# EAGLE schematic OPTOCAPE (EAGLE 6.6.0)
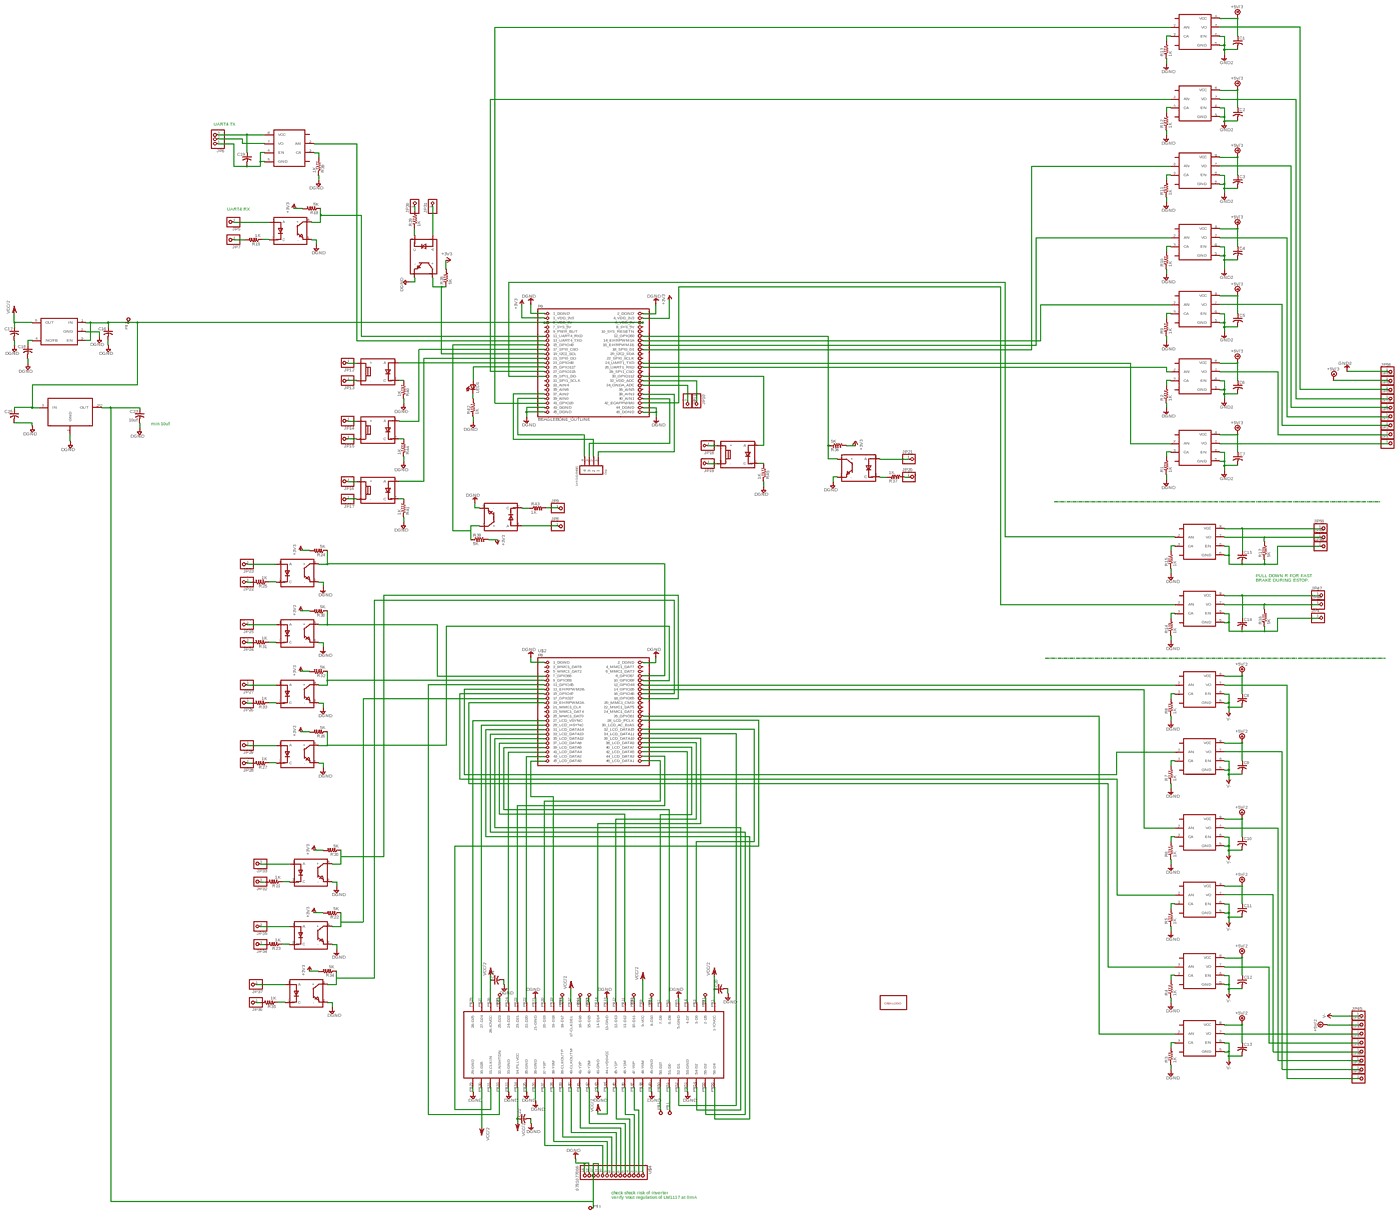
[diagram p0: schematic, sheet 1, overview]
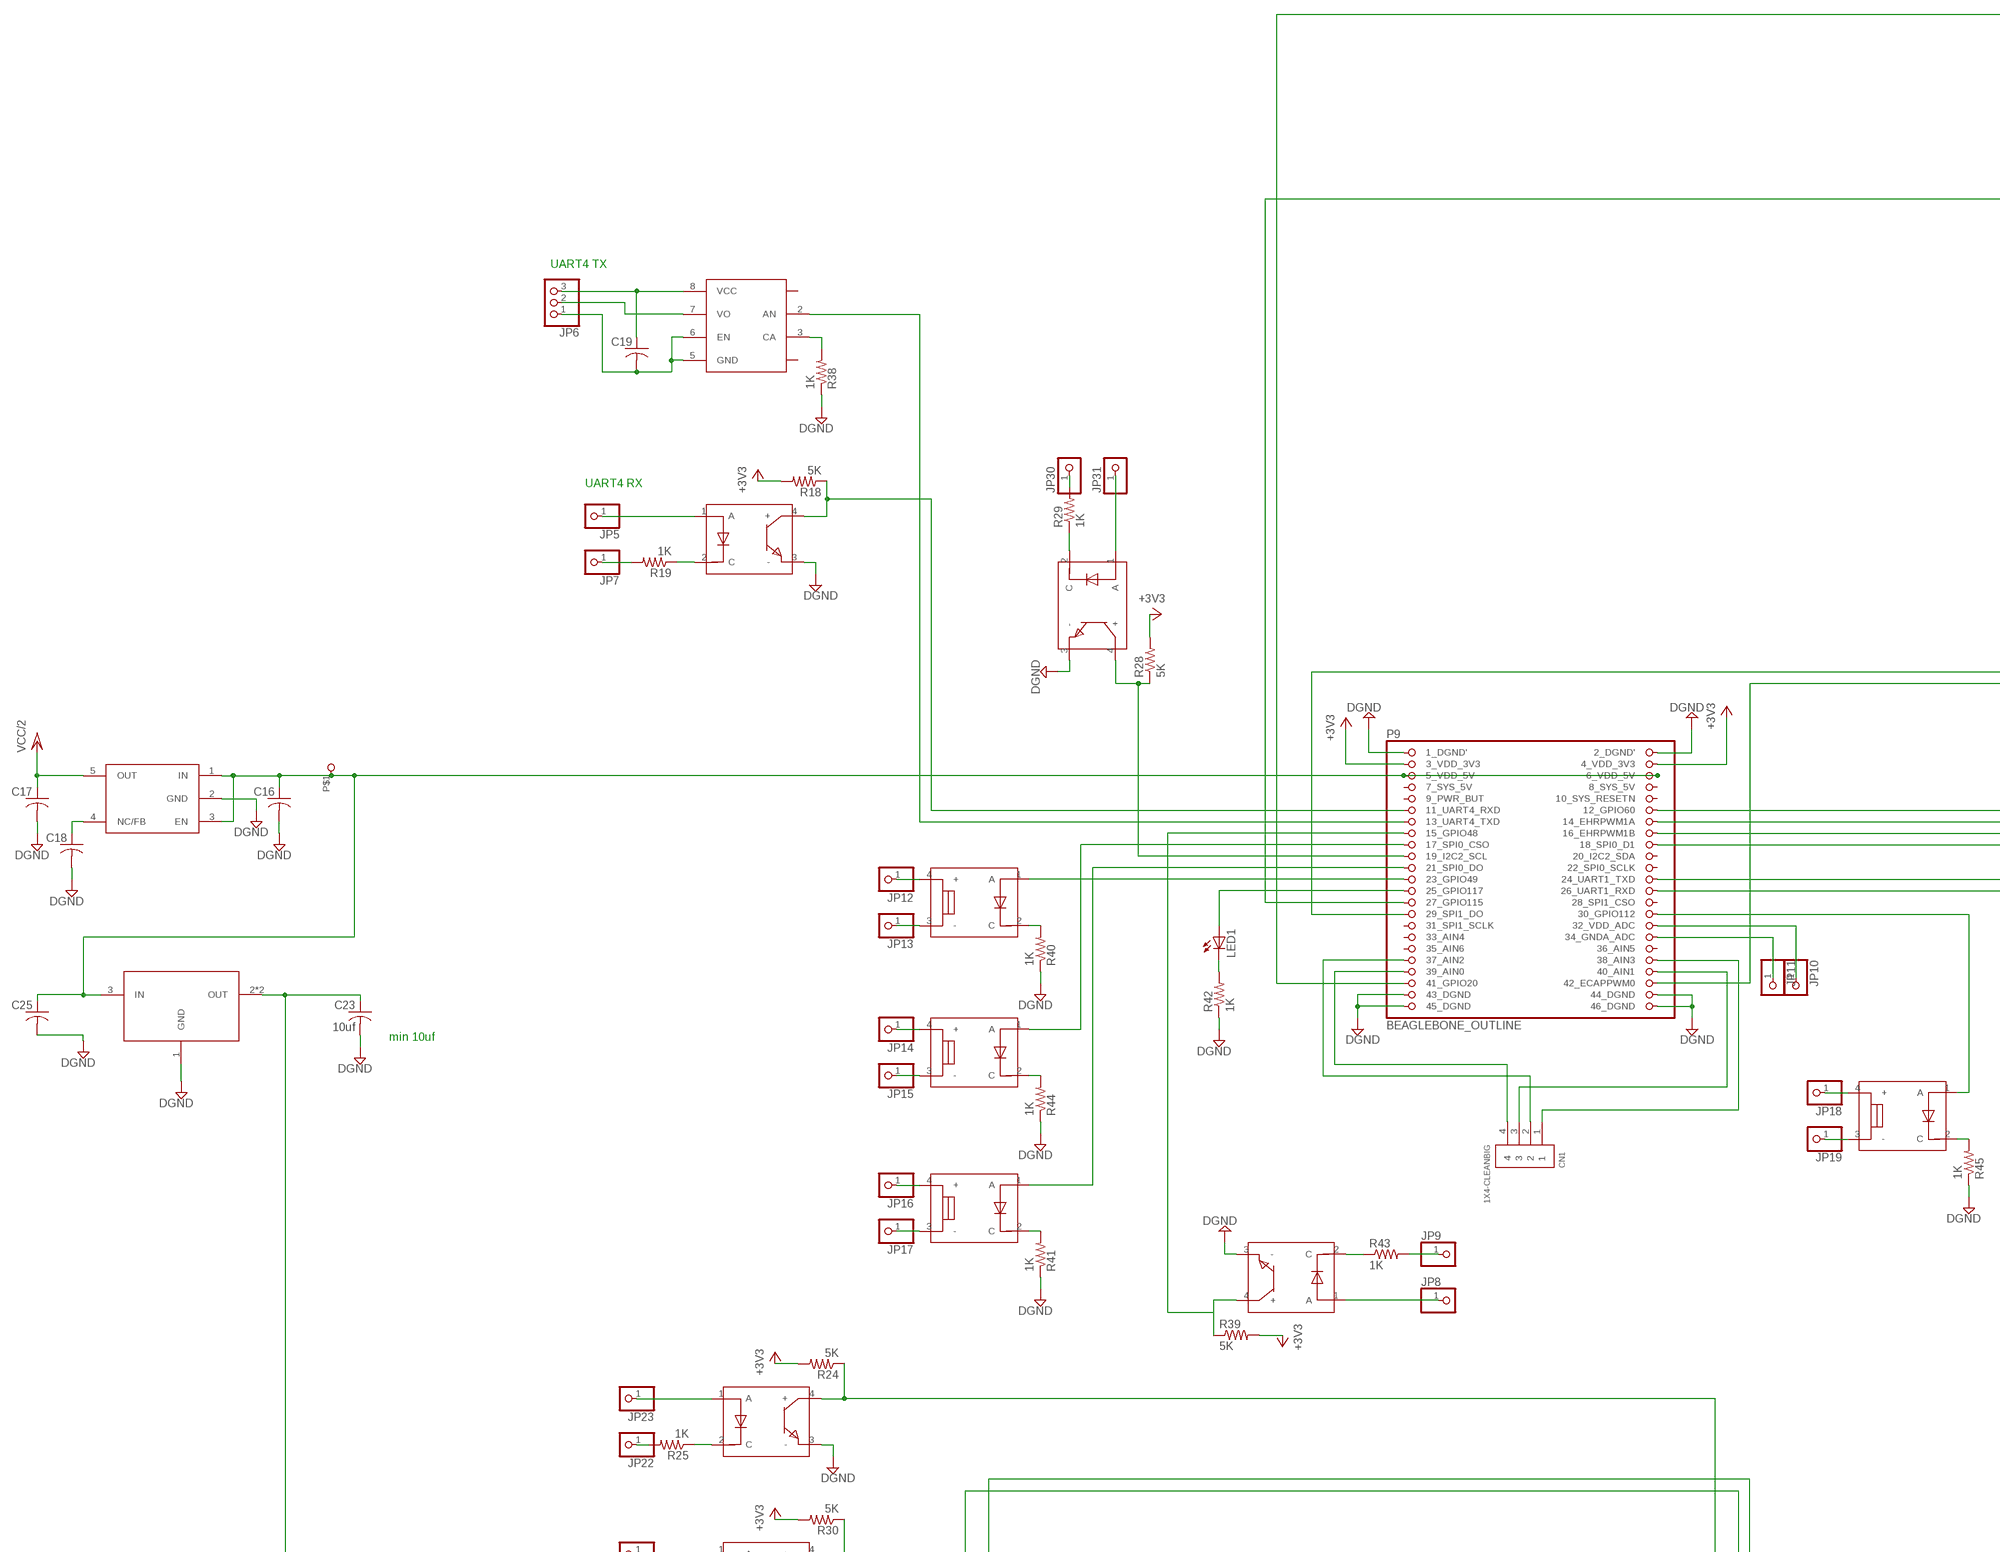
[diagram p1: schematic, sheet 1, part 1 of 4]
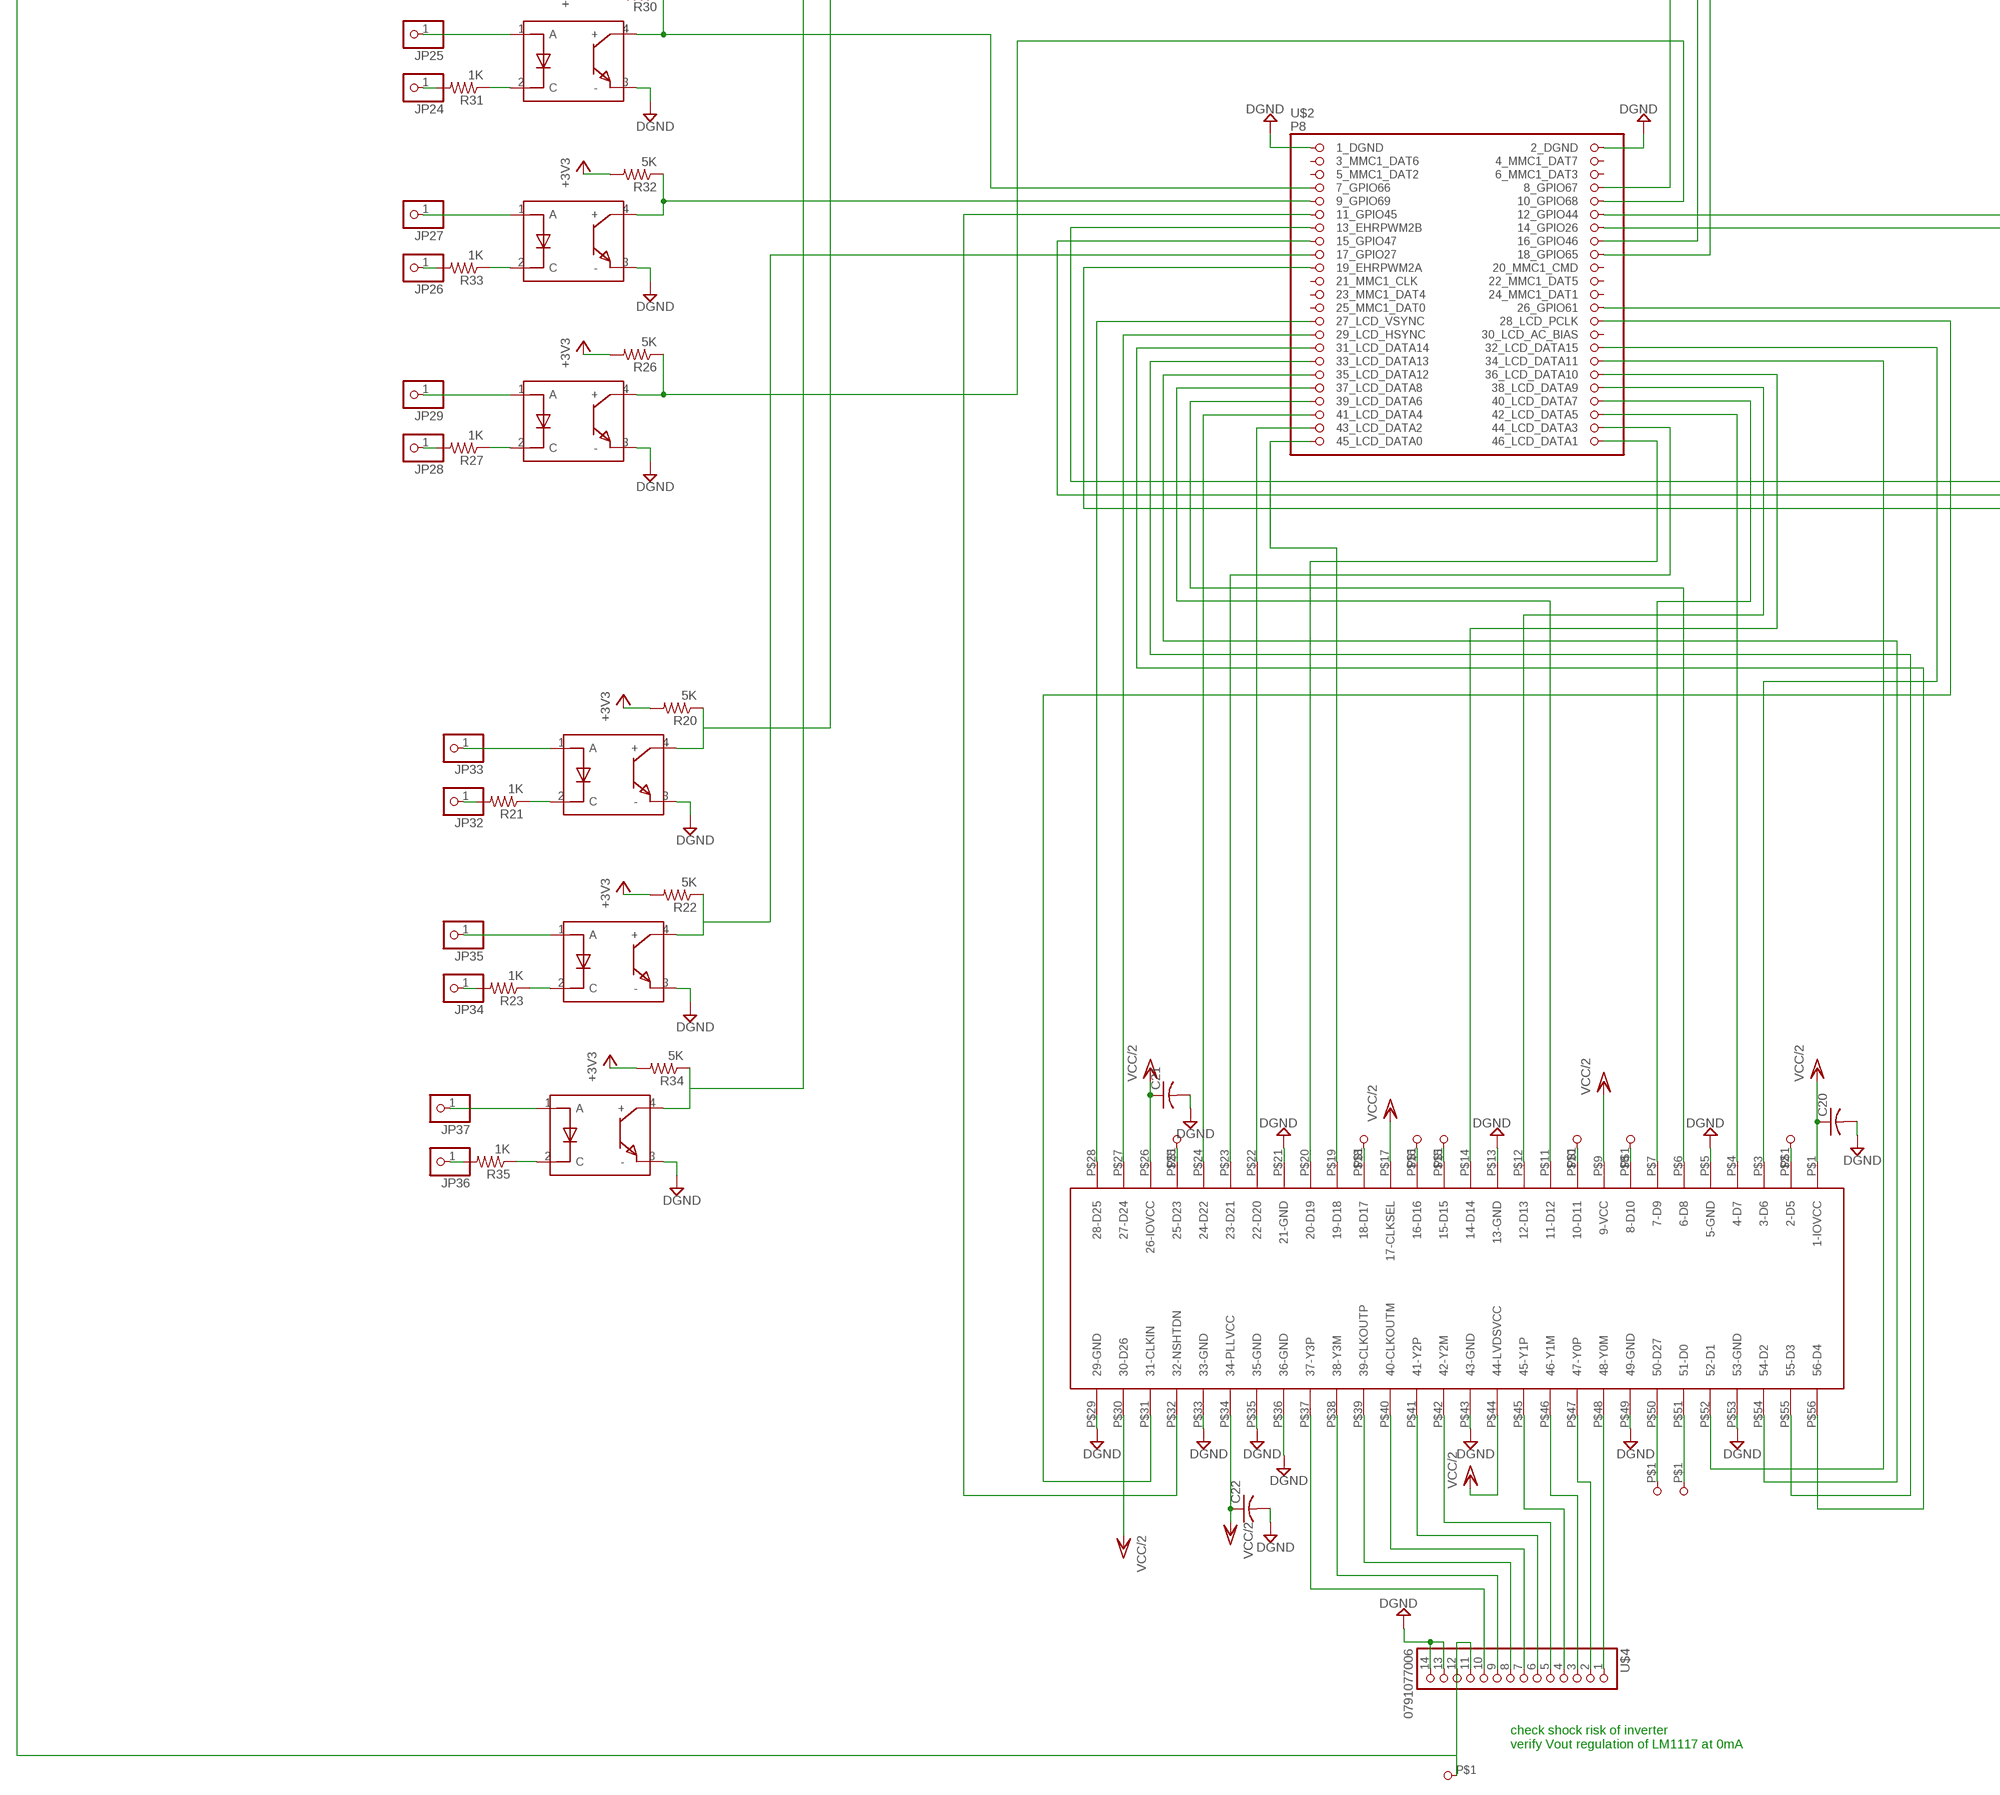
[diagram p2: schematic, sheet 1, part 2 of 4]
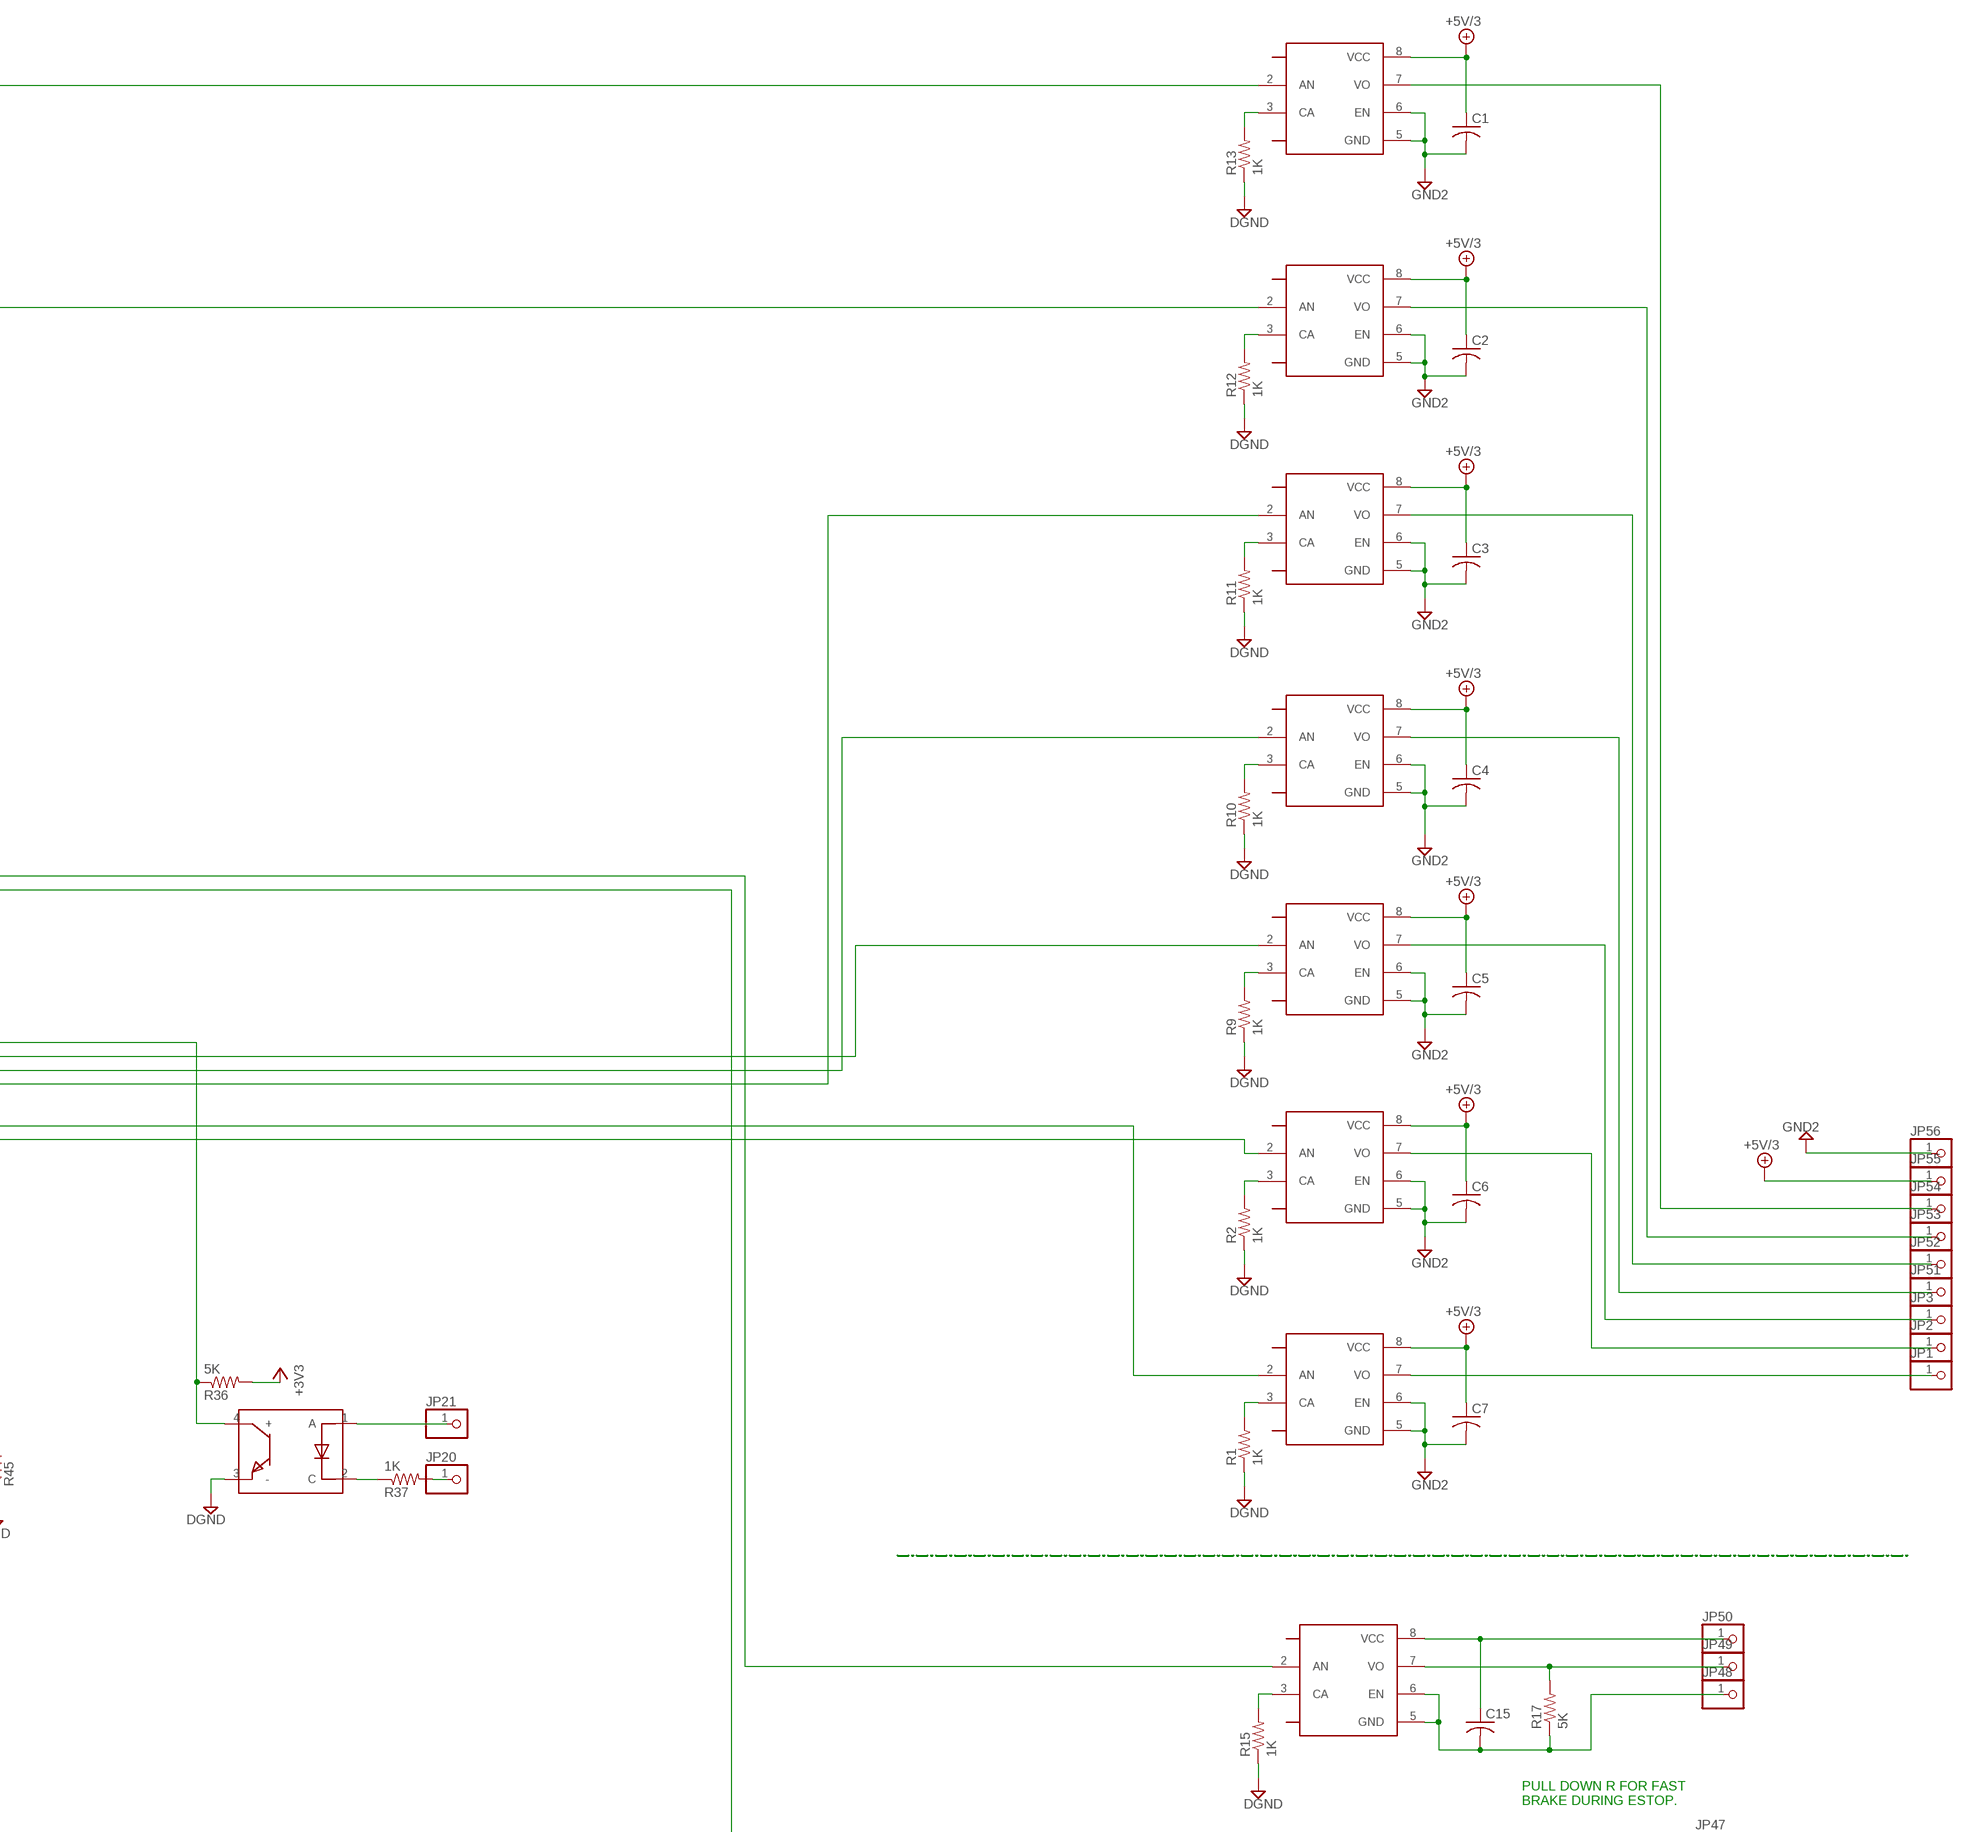
[diagram p3: schematic, sheet 1, part 3 of 4]
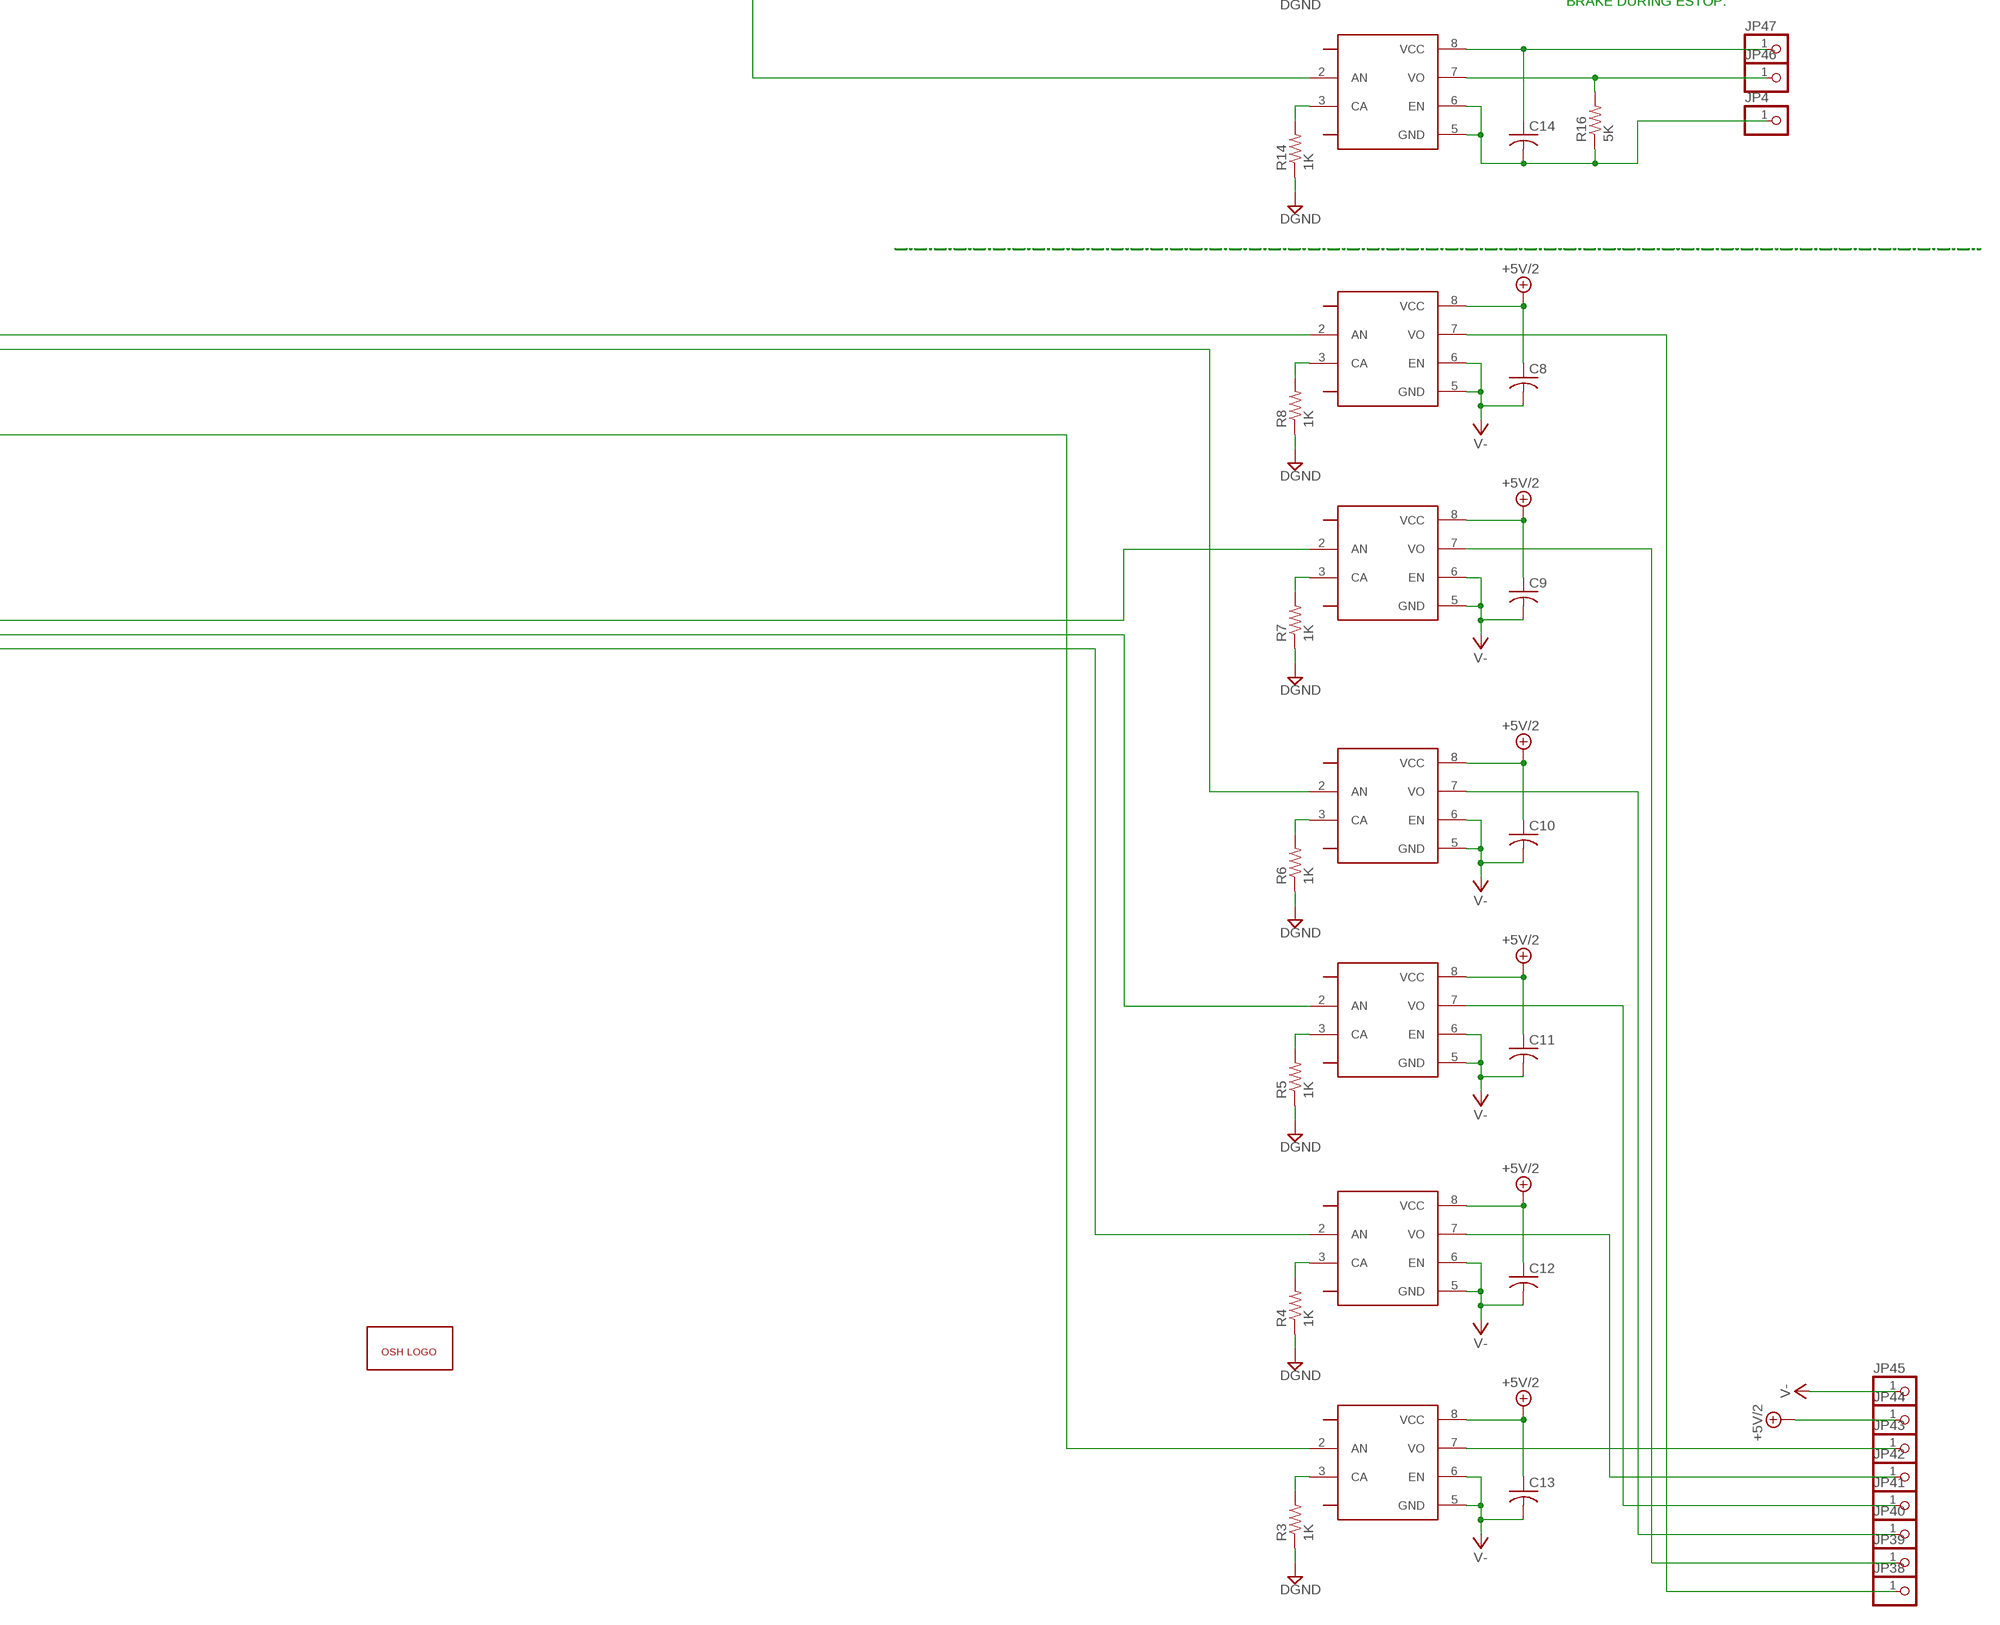
[diagram p4: schematic, sheet 1, part 4 of 4]

## Parts
0000  TLP2200F  [DIL08-ROUND]
8.12  TLP2200F  [DIL08-ROUND]
8.13  TLP2200F  [DIL08-ROUND]
8.14  TLP2200F  [DIL08-ROUND]
8.15  TLP2200F  [DIL08-ROUND]
8.19  TLP2200F  [DIL08-ROUND]
8.26  TLP2200F  [DIL08-ROUND]
9.3  TLP2200F  [DIL08-ROUND]
9.14  TLP2200F  [DIL08-ROUND]
9.16  TLP2200F  [DIL08-ROUND]
9.18  TLP2200F  [DIL08-ROUND]
9.24  TLP2200F  [DIL08-ROUND]
9.26  TLP2200F  [DIL08-ROUND]
9.27  TLP2200F  [DIL08-ROUND]
9.41  TLP2200F  [DIL08-ROUND]
1111  TLP2200F  [DIL08-ROUND]
C1  C-USC0805K  [C0805K]
C2  C-USC0805K  [C0805K]
C3  C-USC0805K  [C0805K]
C4  C-USC0805K  [C0805K]
C5  C-USC0805K  [C0805K]
C6  C-USC0805K  [C0805K]
C7  C-USC0805K  [C0805K]
C8  C-USC0805K  [C0805K]
C9  C-USC0805K  [C0805K]
C10  C-USC0805K  [C0805K]
C11  C-USC0805K  [C0805K]
C12  C-USC0805K  [C0805K]
C13  C-USC0805K  [C0805K]
C14  C-USC0805K  [C0805K]
C15  C-USC0805K  [C0805K]
C16  C-USC0805K  [C0805K]
C17  C-USC0805K  [C0805K]
C18  C-USC0402  [C0402]
C19  C-USC0805K  [C0805K]
C20  C-USC0402  [C0402]
C21  C-USC0402  [C0402]
C22  C-USC0402  [C0402]
C23  10uf  C-USC0805K  [C0805K]
C25  C-USC0402  [C0402]
CN1  1X4-CLEANBIG  [1X04-CLEANBIG]
JP1  PINHD-1X1CB  [1X01-CLEANBIG]
JP2  PINHD-1X1CB  [1X01-CLEANBIG]
JP3  PINHD-1X1CB  [1X01-CLEANBIG]
JP4  PINHD-1X1CB  [1X01-CLEANBIG]
JP5  PINHD-1X1CB  [1X01-CLEANBIG]
JP6  PINHD-1X3CB  [1X03-CLEANBIG]
JP7  PINHD-1X1CB  [1X01-CLEANBIG]
JP8  PINHD-1X1CB  [1X01-CLEANBIG]
JP9  PINHD-1X1CB  [1X01-CLEANBIG]
JP10  PINHD-1X1CB  [1X01-CLEANBIG]
JP11  PINHD-1X1CB  [1X01-CLEANBIG]
JP12  PINHD-1X1CB  [1X01-CLEANBIG]
JP13  PINHD-1X1CB  [1X01-CLEANBIG]
JP14  PINHD-1X1CB  [1X01-CLEANBIG]
JP15  PINHD-1X1CB  [1X01-CLEANBIG]
JP16  PINHD-1X1CB  [1X01-CLEANBIG]
JP17  PINHD-1X1CB  [1X01-CLEANBIG]
JP18  PINHD-1X1CB  [1X01-CLEANBIG]
JP19  PINHD-1X1CB  [1X01-CLEANBIG]
JP20  PINHD-1X1CB  [1X01-CLEANBIG]
JP21  PINHD-1X1CB  [1X01-CLEANBIG]
JP22  PINHD-1X1CB  [1X01-CLEANBIG]
JP23  PINHD-1X1CB  [1X01-CLEANBIG]
JP24  PINHD-1X1CB  [1X01-CLEANBIG]
JP25  PINHD-1X1CB  [1X01-CLEANBIG]
JP26  PINHD-1X1CB  [1X01-CLEANBIG]
JP27  PINHD-1X1CB  [1X01-CLEANBIG]
JP28  PINHD-1X1CB  [1X01-CLEANBIG]
JP29  PINHD-1X1CB  [1X01-CLEANBIG]
JP30  PINHD-1X1CB  [1X01-CLEANBIG]
JP31  PINHD-1X1CB  [1X01-CLEANBIG]
JP32  PINHD-1X1CB  [1X01-CLEANBIG]
JP33  PINHD-1X1CB  [1X01-CLEANBIG]
JP34  PINHD-1X1CB  [1X01-CLEANBIG]
JP35  PINHD-1X1CB  [1X01-CLEANBIG]
JP36  PINHD-1X1CB  [1X01-CLEANBIG]
JP37  PINHD-1X1CB  [1X01-CLEANBIG]
JP38  PINHD-1X1CB  [1X01-CLEANBIG]
JP39  PINHD-1X1CB  [1X01-CLEANBIG]
JP40  PINHD-1X1CB  [1X01-CLEANBIG]
JP41  PINHD-1X1CB  [1X01-CLEANBIG]
JP42  PINHD-1X1CB  [1X01-CLEANBIG]
JP43  PINHD-1X1CB  [1X01-CLEANBIG]
JP44  PINHD-1X1CB  [1X01-CLEANBIG]
JP45  PINHD-1X1CB  [1X01-CLEANBIG]
JP46  PINHD-1X1CB  [1X01-CLEANBIG]
JP47  PINHD-1X1CB  [1X01-CLEANBIG]
JP48  PINHD-1X1CB  [1X01-CLEANBIG]
JP49  PINHD-1X1CB  [1X01-CLEANBIG]
JP50  PINHD-1X1CB  [1X01-CLEANBIG]
JP51  PINHD-1X1CB  [1X01-CLEANBIG]
JP52  PINHD-1X1CB  [1X01-CLEANBIG]
JP53  PINHD-1X1CB  [1X01-CLEANBIG]
JP54  PINHD-1X1CB  [1X01-CLEANBIG]
JP55  PINHD-1X1CB  [1X01-CLEANBIG]
JP56  PINHD-1X1CB  [1X01-CLEANBIG]
LED1  LED5MM  [LED5MM]
R1  1K  R-US_R0603  [R0603]
R2  1K  R-US_R0603  [R0603]
R3  1K  R-US_R0603  [R0603]
R4  1K  R-US_R0603  [R0603]
R5  1K  R-US_R0603  [R0603]
R6  1K  R-US_R0603  [R0603]
R7  1K  R-US_R0603  [R0603]
R8  1K  R-US_R0603  [R0603]
R9  1K  R-US_R0603  [R0603]
R10  1K  R-US_R0603  [R0603]
R11  1K  R-US_R0603  [R0603]
R12  1K  R-US_R0603  [R0603]
R13  1K  R-US_R0603  [R0603]
R14  1K  R-US_R0603  [R0603]
R15  1K  R-US_R0603  [R0603]
R16  5K  R-US_R0603  [R0603]
R17  5K  R-US_R0603  [R0603]
R18  5K  R-US_R0603  [R0603]
R19  1K  R-US_R0603  [R0603]
R20  5K  R-US_R0603  [R0603]
R21  1K  R-US_R0603  [R0603]
R22  5K  R-US_R0603  [R0603]
R23  1K  R-US_R0603  [R0603]
R24  5K  R-US_R0603  [R0603]
R25  1K  R-US_R0603  [R0603]
R26  5K  R-US_R0603  [R0603]
R27  1K  R-US_R0603  [R0603]
R28  5K  R-US_R0603  [R0603]
R29  1K  R-US_R0603  [R0603]
R30  5K  R-US_R0603  [R0603]
R31  1K  R-US_R0603  [R0603]
R32  5K  R-US_R0603  [R0603]
R33  1K  R-US_R0603  [R0603]
R34  5K  R-US_R0603  [R0603]
R35  1K  R-US_R0603  [R0603]
R36  5K  R-US_R0603  [R0603]
R37  1K  R-US_R0603  [R0603]
R38  1K  R-US_R0603  [R0603]
R39  5K  R-US_R0603  [R0603]
R40  1K  R-US_R0603  [R0603]
R41  1K  R-US_R0603  [R0603]
R42  1K  R-US_R0603  [R0603]
R43  1K  R-US_R0603  [R0603]
R44  1K  R-US_R0603  [R0603]
R45  1K  R-US_R0603  [R0603]
SPICS1  TLP222A  [DIL04-ROUND]
SPICS2  TLP222A  [DIL04-ROUND]
SPICS3  TLP222A  [DIL04-ROUND]
SPICS4  TLP222A  [DIL04-ROUND]
TPS73133  TPS76350DBVR  [SOT23-5L]
U$1  FOD817B  [DIL04-ROUND]
U$2  BEAGLEBONE_OUTLINE  [BEAGLEBONE_SHIELD]
U$3  SN75LVDS83B  [DGG0056A]
U$4  0791077006  [0791077006]
U$5  DEAN_SMALL_VIA  [DEAN_SMALL_VIA]
U$6  FOD817B  [DIL04-ROUND]
U$7  FOD817B  [DIL04-ROUND]
U$8  FOD817B  [DIL04-ROUND]
U$9  FOD817B  [DIL04-ROUND]
U$10  FOD817B  [DIL04-ROUND]
U$11  FOD817B  [DIL04-ROUND]
U$12  FOD817B  [DIL04-ROUND]
U$13  FOD817B  [DIL04-ROUND]
U$14  FOD817B  [DIL04-ROUND]
U$15  FOD817B  [DIL04-ROUND]
U$16  DEAN_SMALL_VIA  [DEAN_SMALL_VIA]
U$17  OSH_LOGO  [OSH_LOGO]
U$18  LM1117  [SOT223]
U$19  DEAN_SMALL_VIA  [DEAN_SMALL_VIA]
U$20  DEAN_SMALL_VIA  [DEAN_SMALL_VIA]
U$21  DEAN_SMALL_VIA  [DEAN_SMALL_VIA]
U$22  DEAN_SMALL_VIA  [DEAN_SMALL_VIA]
U$23  DEAN_SMALL_VIA  [DEAN_SMALL_VIA]
U$24  DEAN_SMALL_VIA  [DEAN_SMALL_VIA]
U$25  DEAN_SMALL_VIA  [DEAN_SMALL_VIA]
U$32  DEAN_SMALL_VIA  [DEAN_SMALL_VIA]
U$33  DEAN_SMALL_VIA  [DEAN_SMALL_VIA]

## Nets
8.7: R30.1 U$2.7(7_GPIO66) U$12.4(+)
8.8: R24.1 U$2.8(8_GPIO67) U$9.4(+)
8.9: R32.1 U$2.9(9_GPIO69) U$13.4(+)
8.10: R26.1 U$2.10(10_GPIO68) U$10.4(+)
8.11: U$2.11(11_GPIO45) U$3.P$32(32-NSHTDN)
8.12: 8.12.2(AN) U$2.12(12_GPIO44)
8.13: 8.13.2(AN) U$2.13(13_EHRPWM2B)
8.14: 8.14.2(AN) U$2.14(14_GPIO26)
8.15: 8.15.2(AN) U$2.15(15_GPIO47)
8.16: R34.1 U$2.16(16_GPIO46) U$14.4(+)
8.17: R22.1 U$2.17(17_GPIO27) U$8.4(+)
8.18: R20.1 U$2.18(18_GPIO65) U$7.4(+)
8.19: 8.19.2(AN) U$2.19(19_EHRPWM2A)
8.26: 8.26.2(AN) U$2.26(26_GPIO61)
9.11: R18.1 U$2.57(11_UART4_RXD) U$6.4(+)
9.12: R36.1 U$2.58(12_GPIO60) U$15.4(+)
9.13: 9.3.2(AN) U$2.59(13_UART4_TXD)
9.14: 9.14.2(AN) U$2.60(14_EHRPWM1A)
9.15: R39.1 U$1.4(+) U$2.61(15_GPIO48)
9.16: 9.16.2(AN) U$2.62(16_EHRPWM1B)
9.17: SPICS3.1(A) U$2.63(17_SPI0_CSO)
9.18: 9.18.2(AN) U$2.64(18_SPI0_D1)
9.19: R28.1 U$2.65(19_I2C2_SCL) U$11.4(+)
9.21: SPICS2.1(A) U$2.67(21_SPI0_DO)
9.23: SPICS1.1(A) U$2.69(23_GPIO49)
9.24: 9.24.2(AN) U$2.70(24_UART1_TXD)
9.25: LED1.A U$2.71(25_GPIO117)
9.26: 9.26.2(AN) U$2.72(26_UART1_RXD)
9.27: 9.27.2(AN) U$2.73(27_GPIO115)
9.29: 1111.2(AN) U$2.75(29_SPI1_DO)
9.30: SPICS4.1(A) U$2.76(30_GPIO112)
9.32: JP10.1 U$2.78(32_VDD_ADC)
9.34: JP11.1 U$2.80(34_GNDA_ADC)
9.37: CN1.2 U$2.83(37_AIN2)
9.38: CN1.1 U$2.84(38_AIN3)
9.39: CN1.4 U$2.85(39_AIN0)
9.40: CN1.3 U$2.86(40_AIN1)
9.41: 9.41.2(AN) U$2.87(41_GPIO20)
9.42: 0000.2(AN) U$2.88(42_ECAPPWM0)
+3V3: R18.2 R20.2 R22.2 R24.2 R26.2 R28.2 R30.2 R32.2 R34.2 R36.2 R39.2 U$2.49(3_VDD_3V3) U$2.50(4_VDD_3V3)
+5V/2: 8.12.8(VCC) 8.13.8(VCC) 8.14.8(VCC) 8.15.8(VCC) 8.19.8(VCC) 8.26.8(VCC) C8.1 C9.1 C10.1 C11.1 C12.1 C13.1 JP44.1
DGND: C16.2 C17.2 C18.2 C20.2 C21.2 C22.2 C23.2 C25.2 R1.1 R2.1 R3.1 R4.1 R5.1 R6.1 R7.1 R8.1 R9.1 R10.1 R11.1 R12.1 R13.1 R14.1 R15.1 R38.1 R40.1 R41.1 R42.1 R44.1 R45.1 TPS73133.2(GND) U$1.3(-) U$2.1(1_DGND) U$2.2(2_DGND) U$2.47(1_DGND') U$2.48(2_DGND') U$2.89(43_DGND) U$2.90(44_DGND) U$2.91(45_DGND) U$2.92(46_DGND) U$3.P$5(5-GND) U$3.P$13(13-GND) U$3.P$21(21-GND) U$3.P$29(29-GND) U$3.P$33(33-GND) U$3.P$35(35-GND) U$3.P$36(36-GND) U$3.P$43(43-GND) U$3.P$49(49-GND) U$3.P$53(53-GND) U$4.13 U$4.14 U$6.3(-) U$7.3(-) U$8.3(-) U$9.3(-) U$10.3(-) U$11.3(-) U$12.3(-) U$13.3(-) U$14.3(-) U$15.3(-) U$18.1(GND)
GND2: 9.14.5(GND) 9.14.6(EN) 9.16.5(GND) 9.16.6(EN) 9.18.5(GND) 9.18.6(EN) 9.24.5(GND) 9.24.6(EN) 9.26.5(GND) 9.26.6(EN) 9.27.5(GND) 9.27.6(EN) 9.41.5(GND) 9.41.6(EN) C1.2 C2.2 C3.2 C4.2 C5.2 C6.2 C7.2 JP56.1
HSYNC: U$2.29(29_LCD_HSYNC) U$3.P$27(27-D24)
N$1: 9.24.3(CA) R1.2
N$2: C23.1 U$4.11 U$4.12 U$5.P$1 U$18.2(OUT) U$18.TAB(OUT)
N$4: 9.26.3(CA) R2.2
N$6: 8.26.3(CA) R3.2
N$8: 8.19.3(CA) R4.2
N$10: 8.15.3(CA) R5.2
N$12: 8.14.3(CA) R6.2
N$14: 8.13.3(CA) R7.2
N$16: 8.12.3(CA) R8.2
N$17: 9.26.7(VO) JP2.1
N$18: 9.14.3(CA) R9.2
N$19: 9.24.7(VO) JP1.1
N$20: 9.16.3(CA) R10.2
N$22: 9.18.3(CA) R11.2
N$23: C18.1 TPS73133.4(NC/FB)
N$24: 9.27.3(CA) R12.2
N$26: 9.41.3(CA) R13.2
N$31: 0000.3(CA) R14.2
N$32: 1111.3(CA) R15.2
N$33: 0000.5(GND) 0000.6(EN) C14.2 JP4.1 R16.1
N$34: 1111.5(GND) 1111.6(EN) C15.2 JP48.1 R17.1
N$35: 9.14.7(VO) JP3.1
N$36: 9.16.7(VO) JP51.1
N$37: 9.18.7(VO) JP52.1
N$38: 9.27.7(VO) JP53.1
N$39: 9.41.7(VO) JP54.1
N$45: 0000.8(VCC) C14.1 JP47.1
N$46: 1111.8(VCC) C15.1 JP50.1
N$47: 1111.7(VO) JP49.1 R17.2
N$48: 0000.7(VO) JP46.1 R16.2
N$49: 8.12.7(VO) JP38.1
N$50: 8.13.7(VO) JP39.1
N$51: 8.14.7(VO) JP40.1
N$52: 8.15.7(VO) JP41.1
N$53: 8.19.7(VO) JP42.1
N$54: 8.26.7(VO) JP43.1
N$55: U$2.45(45_LCD_DATA0) U$3.P$19(19-D18)
N$56: U$2.46(46_LCD_DATA1) U$3.P$20(20-D19)
N$57: U$2.43(43_LCD_DATA2) U$3.P$22(22-D20)
N$58: U$2.44(44_LCD_DATA3) U$3.P$23(23-D21)
N$59: U$2.41(41_LCD_DATA4) U$3.P$24(24-D22)
N$60: U$2.42(42_LCD_DATA5) U$3.P$4(4-D7)
N$63: U$2.39(39_LCD_DATA6) U$3.P$6(6-D8)
N$64: U$2.40(40_LCD_DATA7) U$3.P$7(7-D9)
N$65: U$2.37(37_LCD_DATA8) U$3.P$11(11-D12)
N$66: U$2.38(38_LCD_DATA9) U$3.P$12(12-D13)
N$67: U$2.36(36_LCD_DATA10) U$3.P$14(14-D14)
N$68: U$2.34(34_LCD_DATA11) U$3.P$52(52-D1)
N$69: U$2.35(35_LCD_DATA12) U$3.P$54(54-D2)
N$70: U$2.33(33_LCD_DATA13) U$3.P$55(55-D3)
N$71: U$2.31(31_LCD_DATA14) U$3.P$56(56-D4)
N$72: U$2.32(32_LCD_DATA15) U$3.P$3(3-D6)
N$73: U$3.P$2(2-D5) U$19.P$1
N$74: U$3.P$50(50-D27) U$20.P$1
N$75: U$3.P$8(8-D10) U$21.P$1
N$76: U$3.P$10(10-D11) U$22.P$1
N$77: U$3.P$16(16-D16) U$23.P$1
N$78: U$3.P$18(18-D17) U$24.P$1
N$79: U$3.P$25(25-D23) U$25.P$1
N$83: JP12.1 SPICS1.4(+)
N$84: U$3.P$48(48-Y0M) U$4.1
N$85: U$3.P$47(47-Y0P) U$4.2
N$86: U$3.P$46(46-Y1M) U$4.3
N$87: U$3.P$45(45-Y1P) U$4.4
N$88: U$3.P$42(42-Y2M) U$4.5
N$89: U$3.P$41(41-Y2P) U$4.6
N$90: U$3.P$40(40-CLKOUTM) U$4.7
N$91: U$3.P$39(39-CLKOUTP) U$4.8
N$92: U$3.P$38(38-Y3M) U$4.9
N$93: U$3.P$37(37-Y3P) U$4.10
N$94: JP21.1 U$15.1(A)
N$97: R19.1 U$6.2(C)
N$100: U$3.P$51(51-D0) U$32.P$1
N$101: U$3.P$15(15-D15) U$33.P$1
N$102: JP13.1 SPICS1.3(-)
N$103: JP14.1 SPICS3.4(+)
N$104: JP15.1 SPICS3.3(-)
N$105: C16.1 C25.1 TPS73133.1(IN) TPS73133.3(EN) U$2.51(5_VDD_5V) U$2.52(6_VDD_5V) U$16.P$1 U$18.3(IN)
N$106: R21.1 U$7.2(C)
N$108: R23.1 U$8.2(C)
N$110: R25.1 U$9.2(C)
N$111: R45.2 SPICS4.2(C)
N$112: R27.1 U$10.2(C)
N$114: R29.1 U$11.2(C)
N$116: R31.1 U$12.2(C)
N$117: JP16.1 SPICS2.4(+)
N$118: R33.1 U$13.2(C)
N$120: R35.1 U$14.2(C)
N$122: R37.1 U$15.2(C)
N$123: 9.3.3(CA) R38.2
N$125: R40.2 SPICS1.2(C)
N$126: R41.2 SPICS2.2(C)
N$127: LED1.K(C) R42.2
N$129: 9.3.7(VO) JP6.2
N$130: 9.3.5(GND) 9.3.6(EN) C19.2 JP6.1
N$132: JP5.1 U$6.1(A)
N$133: JP7.1 R19.2
N$134: R43.1 U$1.2(C)
N$135: JP8.1 U$1.1(A)
N$136: JP9.1 R43.2
N$137: 9.3.8(VCC) C19.1 JP6.3
N$139: R44.2 SPICS3.2(C)
N$142: JP17.1 SPICS2.3(-)
N$143: JP19.1 SPICS4.3(-)
N$144: JP18.1 SPICS4.4(+)
N$146: JP20.1 R37.2
N$147: JP36.1 R35.2
N$148: JP37.1 U$14.1(A)
N$149: JP34.1 R23.2
N$150: JP35.1 U$8.1(A)
N$151: JP32.1 R21.2
N$152: JP33.1 U$7.1(A)
N$153: JP30.1 R29.2
N$154: JP31.1 U$11.1(A)
N$155: JP28.1 R27.2
N$156: JP29.1 U$10.1(A)
N$157: JP26.1 R33.2
N$158: JP27.1 U$13.1(A)
N$159: JP24.1 R31.2
N$160: JP25.1 U$12.1(A)
N$161: JP22.1 R25.2
N$162: JP23.1 U$9.1(A)
PCLK: U$2.28(28_LCD_PCLK) U$3.P$31(31-CLKIN)
V-: 8.12.5(GND) 8.12.6(EN) 8.13.5(GND) 8.13.6(EN) 8.14.5(GND) 8.14.6(EN) 8.15.5(GND) 8.15.6(EN) 8.19.5(GND) 8.19.6(EN) 8.26.5(GND) 8.26.6(EN) C8.2 C9.2 C10.2 C11.2 C12.2 C13.2 JP45.1
VCC/2: C17.1 C20.1 C21.1 C22.1 TPS73133.5(OUT) U$3.P$1(1-IOVCC) U$3.P$9(9-VCC) U$3.P$17(17-CLKSEL) U$3.P$26(26-IOVCC) U$3.P$30(30-D26) U$3.P$34(34-PLLVCC) U$3.P$44(44-LVDSVCC)
VSYNC: U$2.27(27_LCD_VSYNC) U$3.P$28(28-D25)
XXXXXX: 9.14.8(VCC) 9.16.8(VCC) 9.18.8(VCC) 9.24.8(VCC) 9.26.8(VCC) 9.27.8(VCC) 9.41.8(VCC) C1.1 C2.1 C3.1 C4.1 C5.1 C6.1 C7.1 JP55.1 ; supply symbol labelled +5V/3
Unconnected: U$2.3(3_MMC1_DAT6) U$2.4(4_MMC1_DAT7) U$2.5(5_MMC1_DAT2) U$2.6(6_MMC1_DAT3) U$2.20(20_MMC1_CMD) U$2.21(21_MMC1_CLK) U$2.22(22_MMC1_DAT5) U$2.23(23_MMC1_DAT4) U$2.24(24_MMC1_DAT1) U$2.25(25_MMC1_DAT0) U$2.30(30_LCD_AC_BIAS) U$2.54(8_SYS_5V) U$2.55(9_PWR_BUT) U$2.56(10_SYS_RESETN) U$2.66(20_I2C2_SDA) U$2.68(22_SPI0_SCLK) U$2.74(28_SPI1_CSO) U$2.77(31_SPI1_SCLK) U$2.79(33_AIN4) U$2.81(35_AIN6) U$2.82(36_AIN5)

## Notes on the sheet
- UART4 TX
- UART4 RX
- min 10uf
- PULL DOWN R FOR FAST 
  BRAKE DURING ESTOP.
- check shock risk of inverter
  verify Vout regulation of LM1117 at 0mA

## Power pins joined to a net without a drawn wire
7_SYS_5V: U$2.53(7_SYS_5V)

## Library data of the parts
0000 8.12-8.15 8.19 8.26 9.3 9.14 9.16 9.18 9.24 9.26 9.27 9.41 1111 = Dean:TLP2200F
C1-C15 C19 = rcl:C-US: CAPACITOR, American symbol
C16-C18 C20-C23 C25 = Dean:C-US: CAPACITOR, American symbol
CN1 = Dean:1X4: 4-pin connector
JP1-JP5 JP7-JP56 = Dean:PINHD-1X1: Pin header 1x1 for 0.1" spacing With round pins
JP6 = Dean:PINHD-1X3: PIN HEADER
LED1 = Dean:LED: LED OSRAM: - CHIPLED LG R971, LG N971, LY N971, LG Q971, LY Q971, LO R971, LY R971 LH N974, LH R974 LS Q976, LO Q976, LY Q976 LO Q996 - Hyper CHIPLED LW Q18S LB Q993, LB Q99A, LB R99A - SideLED LS A670, LO A670, LY A670, LG A670, LP A670 LB A673, LV A673, LT A673, LW A673 LH A674 LY A675 LS A676, LA A676, LO A676, LY A676, LW A676 LS A679, LY A679, LG A679 - Hyper Micro SIDELED® LS Y876, LA Y876, LO Y876, LY Y876 LT Y87S - SmartLED LW L88C, LW L88S LB L89C, LB L89S, LG L890 LS L89K, LO L89K, LY L89K LS L896, LA L896, LO L896, LY L896 - TOPLED LS T670, LO T670, LY T670, LG T670, LP T670 LSG T670, LSP T670, LSY T670, LOP T670, LYG T670 LG T671, LOG T671, LSG T671 LB T673, LV T673, LT T673, LW T673 LH T674 LS T676, LA T676, LO T676, LY T676, LB T676, LH T676, LSB T676, LW T676 LB T67C, LV T67C, LT T67C, LS T67K, LO T67K, LY T67K, LW E67C LS E67B, LA E67B, LO E67B, LY E67B, LB E67C, LV E67C, LT E67C LW T67C LS T679, LY T679, LG T679 LS T770, LO T770, LY T770, LG T770, LP T770 LB T773, LV T773, LT T773, LW T773 LH T774 LS E675, LA E675, LY E675, LS T675 LS T776, LA T776, LO T776, LY T776, LB T776 LHGB T686 LT T68C, LB T68C - Hyper Mini TOPLED® LB M676 - Mini TOPLED Santana® LG M470 LS M47K, LO M47K, LY M47K Source: http://www.osram.convergy.de/
R1-R45 = rcl:R-US_: RESISTOR, American symbol
SPICS1-SPICS4 = Dean:TLP222A
TPS73133 = Dean:TPS76350DBVR
U$1 U$6-U$15 = Dean:FOD817B
U$2 = adafruit:BEAGLEBONE_OUTLINE: Should match A3 pinout - but not completely tested
U$3 = Dean:SN75LVDS83B
U$4 = Dean:0791077006
U$5 U$16 U$19-U$25 U$32 U$33 = Dean:DEAN_SMALL_VIA
U$17 = Dean:OSH_LOGO
U$18 = Dean:LM1117